# EAGLE design hamilton (EAGLE 6.5.0)
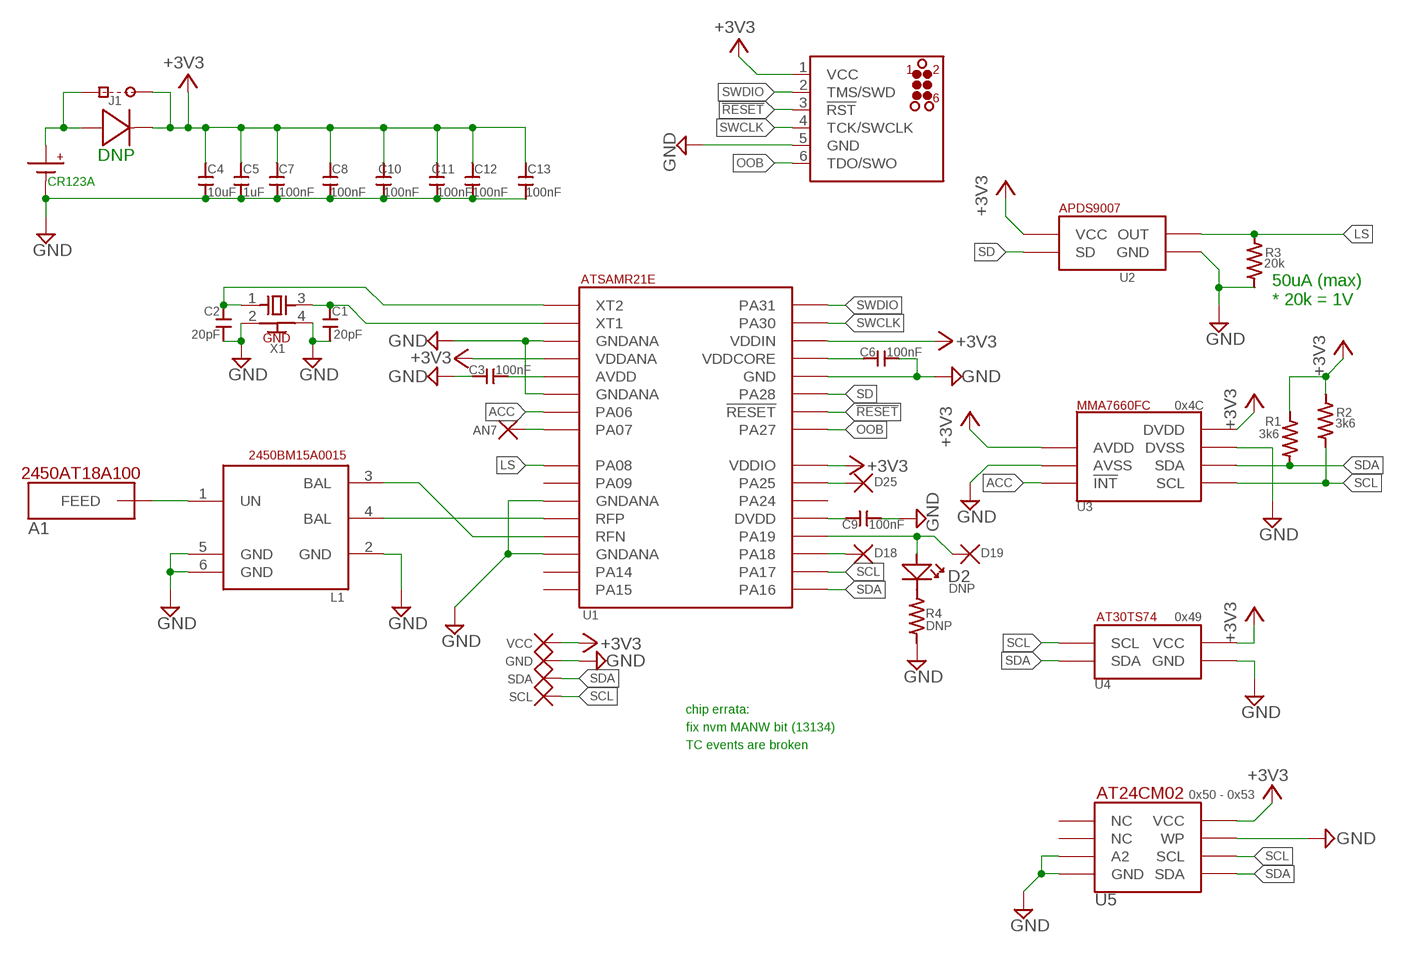
[diagram p0: schematic, sheet 1]

## Parts
A1  JOHANSON_ANTENNA2  [JOHANSON_ANTENNA2]
BT1  2/3A  [2/3A]
C1  20pF  0603_CAPACITORSMALL  [S0402]
C2  20pF  0603_CAPACITORSMALL  [S0402]
C3  100nF  0603_CAPACITOR0402  [C0402]
C4  10uF  0805_CAPACITOR  [0805]
C5  1uF  0603_CAPACITOR0402  [C0402]
C6  100nF  0603_CAPACITOR0402  [C0402]
C7  100nF  0603_CAPACITOR0402  [C0402]
C8  100nF  0603_CAPACITOR0402  [C0402]
C9  100nF  0603_CAPACITOR0402  [C0402]
C10  100nF  0603_CAPACITOR0402  [C0402]
C11  100nF  0603_CAPACITOR0402  [C0402]
C12  100nF  0603_CAPACITOR0402  [C0402]
C13  100nF  0603_CAPACITOR0402  [C0402]
D1  SOD523F  [SOD523F]
D2  DNP  STATLED  [LINE_0805]
J1  CUTJ2  [CUT3]
L1  BALUN_JOHANSON  [BALUN_JOHANSON]
R1  3k6  0603_RESISTORSMALL  [S0402]
R2  3k6  0603_RESISTORSMALL  [S0402]
R3  20k  0603_RESISTORSMALL  [S0402]
R4  DNP  0603_RESISTORSMALL  [S0402]
TP1  D19  TP  [TPP]
TP2  D18  TP  [TPP]
TP3  AN7  TP  [TPP]
TP4  D25  TP  [TPP]
TP5  VCC  TP  [TPP]
TP6  GND  TP  [TPP]
TP7  SDA  TP  [TPP]
TP8  SCL  TP  [TPP]
U1  SAMR21  [QFN32]
U2  APDS9007  [APDS9007]
U3  MMA7660FC  [MMA7660]
U4  AT30TS74  [4WLCSP]
U5  AT24CM02  [SO8]
U$1  JLINK_CONNECT  [TC2030-MCP-NL]
X1  XTAL  [XTAL]

## Nets
!RESET!: U1.26(!RESET!) U$1.3(!RST!)
+3V3: C4.2 C5.2 C7.1 C8.1 C10.1 C11.1 C12.1 C13.1 D1.NEG J1.P$1(R) R1.P$2 R2.P$2 TP5.P$1 U1.4(VDDANA) U1.24(VDDIO) U1.30(VDDIN) U2.4(VCC) U3.3(AVDD) U3.9(DVDD) U4.A1(VCC) U5.8(VCC) U$1.1(VCC)
ACC: U1.7(PA06) U3.5(!INT!)
GND: BT1.NEG(-) C1.P$1 C2.P$1 C3.2 C4.1 C5.1 C6.1 C7.2 C8.2 C9.1 C10.2 C11.2 C12.2 C13.2 L1.2(GND) L1.5(GND) L1.6(GND) R3.P$1 R4.P$1 TP6.P$1 U1.3(GNDANA) U1.6(GNDANA) U1.11(GNDANA) U1.14(GNDANA) U1.28(GND) U2.1(GND) U3.4(AVSS) U3.8(DVSS) U4.A2(GND) U5.3(A2) U5.4(GND) U5.7(WP) U$1.5(GND) X1.2(GND) X1.4(GND)
LS: R3.P$2 U1.9(PA08) U2.3(OUT)
N$1: BT1.POS(+) D1.POS J1.P$2(SQ)
N$2: L1.3(BAL) U1.13(RFN)
N$3: A1.FEED L1.1(UN)
N$4: C2.P$2 U1.1(XT2) X1.1(X1)
N$5: C6.2 U1.29(VDDCORE)
N$6: C3.1 U1.5(AVDD)
N$7: C1.P$2 U1.2(XT1) X1.3(X2)
N$8: TP3.P$1 U1.8(PA07)
N$9: TP4.P$1 U1.23(PA25)
N$10: C9.2 U1.21(DVDD)
N$11: D2.NOLINE(+) TP1.P$1 U1.20(PA19)
N$12: TP2.P$1 U1.19(PA18)
N$13: L1.4(BAL) U1.12(RFP)
N$14: D2.LINE(-) R4.P$2
OOB: U1.25(PA27) U$1.6(TDO/SWO)
SCL: R2.P$1 TP8.P$1 U1.18(PA17) U3.6(SCL) U4.B2(SCL) U5.6(SCL)
SD: U1.27(PA28) U2.6(SD)
SDA: R1.P$1 TP7.P$1 U1.17(PA16) U3.7(SDA) U4.B1(SDA) U5.5(SDA)
SWCLK: U1.31(PA30) U$1.4(TCK/SWCLK)
SWDIO: U1.32(PA31) U$1.2(TMS/SWD)
Unconnected: U1.10(PA09) U1.15(PA14) U1.16(PA15) U1.22(PA24) U5.1(NC) U5.2(NC)

## Notes on the sheet
- DNP
- CR123A
- 50uA (max) 
  * 20k = 1V
- X1
- 0x4C
- DNP
- 0x49
- chip errata:
- fix nvm MANW bit (13134)
- TC events are broken
- 0x50 - 0x53

## Library data of the parts
A1 = storm:JOHANSON_ANTENNA2
BT1 = storm:2/3A
C1-C3 C5-C13 = storm:0603_CAPACITOR
C4 = storm:0805_CAPACITOR
D1 = storm:SOD523F
D2 = storm:STATLED
J1 = storm:CUTJ2
L1 = storm:BALUN_JOHANSON
R1-R4 = storm:0603_RESISTOR
TP1-TP8 = storm:TP
U1 = storm:SAMR21
U2 = storm:APDS9007
U3 = storm:MMA7660FC
U4 = storm:AT30TS74
U5 = storm:AT24CM02
U$1 = storm:JLINK_CONNECT
X1 = storm:XTAL

## Board
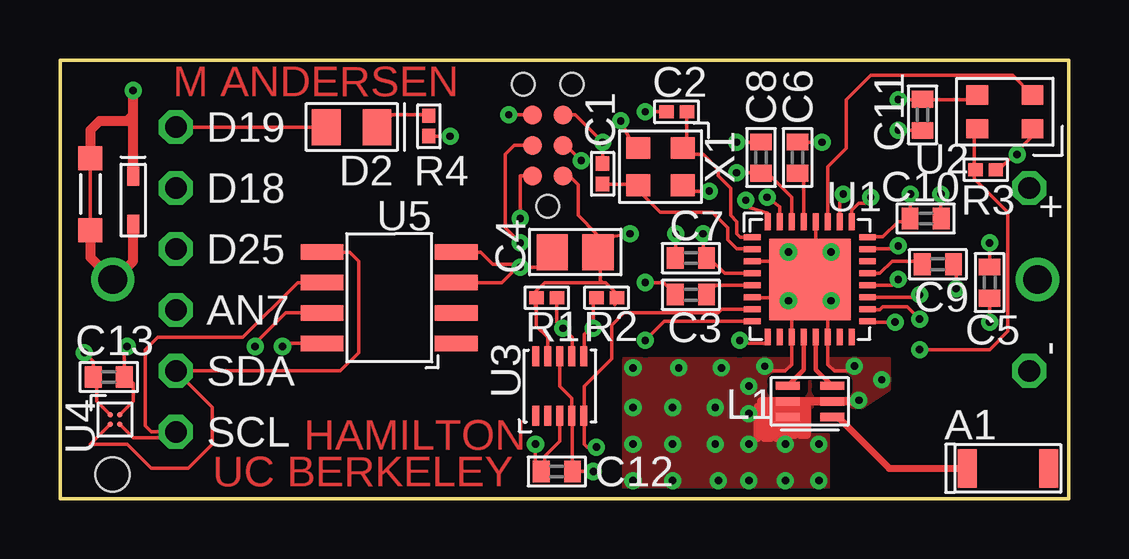
[diagram p1: board, top side]
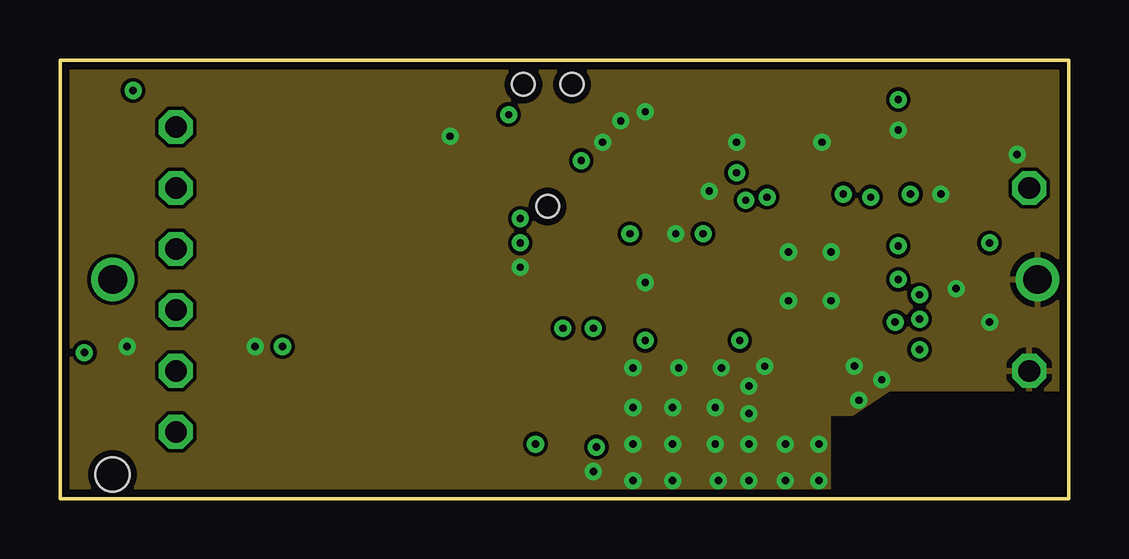
[diagram p2: board, inner layer Route2]
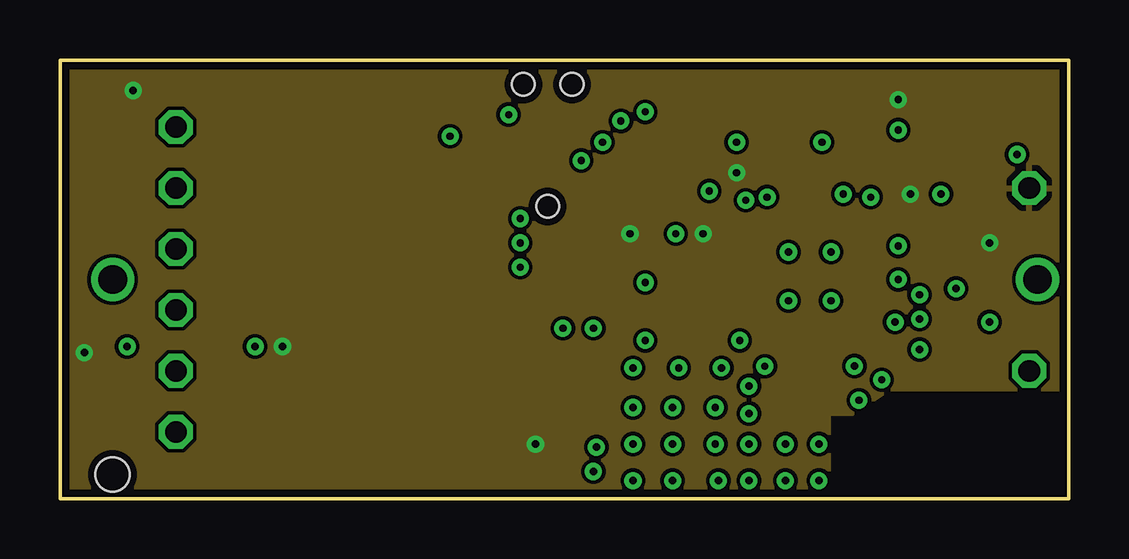
[diagram p3: board, inner layer Route15]
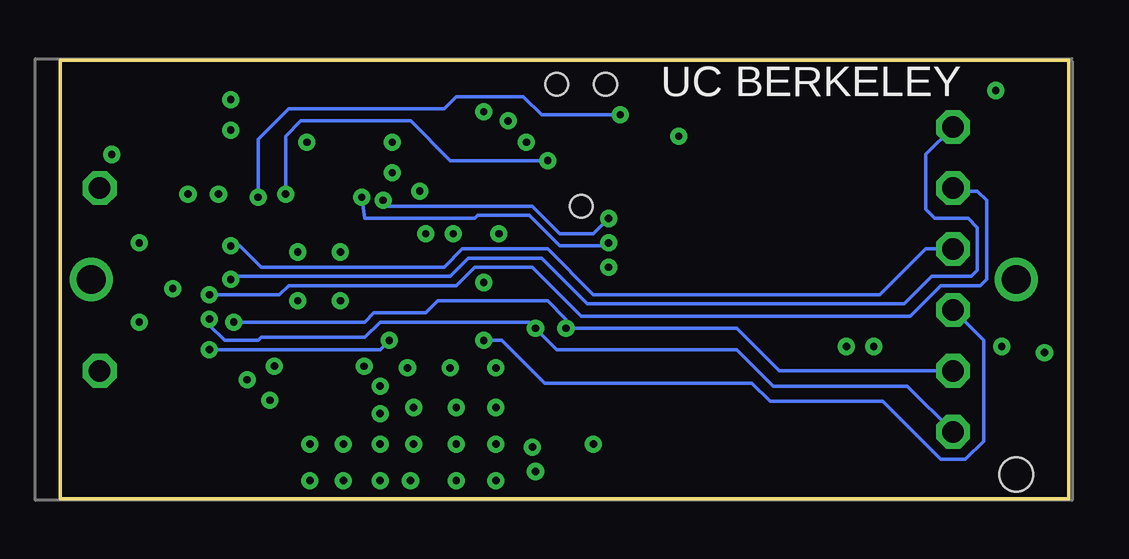
[diagram p4: board, bottom side, seen from below]

Size 42.04 x 18.29 mm. Coordinates in mm from the lower left corner, seen from the top.
Outline: 0,18.29 42.04,18.29 42.04,0 0,0 0,18.29
Copper layers (1*2*15*16): Top 0.035mm / dielectric 1.5mm / Route2 0.035mm / dielectric 0.15mm / Route15 0.035mm / dielectric 0.2mm / Bottom 0.035mm
Design rules "default *": minimum track width 6mil, minimum drill 12mil, track to track 6mil, track to pad 6mil, pad to pad 6mil, via to via 6mil, smd to smd 6mil, copper to edge 12mil, drill to drill 8mil, minimum pad ring 10mil, minimum via ring 8mil, stop-mask expansion 4mil, vias tented up to drill 12mil, thermal gap 10mil

### Footprints (pad centres in the part's own frame; a part is rotated, then mirrored left to right if it is on the bottom)
JOHANSON_ANTENNA2 = smd 0.8 x 1.6: FEED -1.7,0; NC 1.7,0
2/3A = drill 1.2: NEG -19.27,0; POS 19.27,0 | hole 1.42: 19.27,-8.13
S0402 = smd 0.6 x 0.55: P$1 0,0; P$2 0.85,0
C0402 = smd 0.7 x 0.9: 1 -0.65,0; 2 0.65,0
0805 = smd 1.3 x 1.5: 1 -0.95,0; 2 0.95,0
SOD523F = smd 0.8 x 0.5: NEG 1,0; POS -1,0
LINE_0805 = smd 1.2 x 1.5: LINE 0,0; NOLINE 2.11,0
CUT3 = smd 1 x 1: P$1 -1.5,0; P$2 1.5,0
BALUN_JOHANSON = smd 1 x 0.35: 1 -0.925,0.65; 2 -0.925,0; 3 -0.925,-0.65; 4 0.925,-0.65; 5 0.925,0; 6 0.925,0.65
TPP = drill 0.9 octagon: P$1 0,0
QFN32 = smd 0.7 x 0.25: 1 -2.4,1.75; 2 -2.4,1.25; 3 -2.4,0.75; 4 -2.4,0.25; 5 -2.4,-0.25; 6 -2.4,-0.75; 7 -2.4,-1.25; 8 -2.4,-1.75; 17 2.4,-1.75; 18 2.4,-1.25; 19 2.4,-0.75; 20 2.4,-0.25; 21 2.4,0.25; 22 2.4,0.75; 23 2.4,1.25; 24 2.4,1.75 | smd 0.25 x 0.7: 9 -1.75,-2.4; 10 -1.25,-2.4; 11 -0.75,-2.4; 12 -0.25,-2.4; 13 0.25,-2.4; 14 0.75,-2.4; 15 1.25,-2.4; 16 1.75,-2.4; 25 1.75,2.4; 26 1.25,2.4; 27 0.75,2.4; 28 0.25,2.4; 29 -0.25,2.4; 30 -0.75,2.4; 31 -1.25,2.4; 32 -1.75,2.4 | smd 3.4 x 3.4: PAD 0,0
APDS9007 = smd 0.9 x 0.8: 1 -1.15,0.7; 3 1.15,0.7; 4 1.15,-0.7; 6 -1.15,-0.7
MMA7660 = smd 0.3 x 0.825: 1 -1,-1.24; 2 -0.5,-1.24; 3 0,-1.24; 4 0.5,-1.24; 5 1,-1.24; 6 1,1.24; 7 0.5,1.24; 8 0,1.24; 9 -0.5,1.24; 10 -1,1.24
4WLCSP = smd 0.235 x 0.235: A1 -0.2,0.2; A2 0.2,0.2; B1 -0.2,-0.2; B2 0.2,-0.2
SO8 = smd 1.778 x 0.635: 1 -2.54,2.54; 2 -2.54,1.27; 3 -2.54,0; 4 -2.54,-1.27; 5 3.048,-1.27; 6 3.048,0; 7 3.048,1.27; 8 3.048,2.54
TC2030-MCP-NL = smd 0.787 x 0.787: 1 1.27,-0.635; 2 1.27,0.635; 3 2.54,-0.635; 4 2.54,0.635; 5 3.81,-0.635; 6 3.81,0.635 | hole 0.95: 0,0; 5.08,-1.016; 5.08,1.016
XTAL = smd 1 x 0.9: 1 -0.925,-0.775; 2 0.925,-0.775; 3 0.925,0.775; 4 -0.925,0.775

### Placement (x,y rotation side)
A1  39.5,1.27 0 top
BT1  21.46,9.14 0 bottom
C1  22.61,13.97 270 top
C2  25.27,16.13 0 top
C3  26.29,8.51 180 top
C4  21.46,10.29 0 top
C5  38.73,9.02 90 top
C6  30.73,14.22 270 top
C7  26.29,10.03 180 top
C8  29.21,14.22 90 top
C9  36.58,9.78 180 top
C10  36.07,11.68 0 top
C11  35.94,16 270 top
C12  20.7,1.14 0 top
C13  2.03,5.08 0 top
D1  3.05,12.45 90 top
D2  13.21,15.49 180 top
J1  1.27,12.7 270 top
L1  31.24,4.06 180 top
R1  20.7,8.38 180 top
R2  22.35,8.38 0 top
R3  38.99,13.72 180 top
R4  15.37,15.11 90 top
TP1  4.83,15.49 0 top
TP2  4.83,12.95 0 top
TP3  4.83,7.87 0 top
TP4  4.83,10.41 0 top
TP5  40.39,12.95 180 top
TP6  40.39,5.33 180 top
TP7  4.83,5.34 0 top
TP8  4.83,2.79 0 top
U1  31.24,9.14 0 top
U2  39.37,16.13 180 top
U3  20.83,4.7 0 top
U4  2.29,3.3 0 top
U5  13.97,9.02 180 top
U$1  20.32,12.19 90 top
X1  25.02,13.84 180 top

### Tracks (layer width: path | path; a pad name or v marks a point on that pad's centre or on a via)
!RESET!  (via drill 0.3)
  Top 0.152: U1.26 32.49,12.55 v32.64,12.7 | v21.72,14.1 21.08,14.73 U$1.3
  Bottom 0.152: v32.64,12.7 32.64,15.11 32,15.75 27.43,15.75 25.78,14.1 v21.72,14.1
+3V3  (via drill 0.3)
  Top 0.152: U1.4 27.69,9.39 27.05,10.03 27.05,10.16 26.99,10.22 | 26.99,10.22 26.8,10.41 v26.8,11.05 | U1.24 33.67,10.92 34.29,10.92 34.93,11.56 35.29,11.56 35.4,11.67 35.42,11.67 C10.1 35.43,11.7 v35.43,12.7 | U2.4 38.03,16.64 v34.93,16.64 35.93,16.64 C11.1 | 22.51,10.19 22.54,10.16 | U3.3 20.83,2.41 20.19,1.78 20.19,1.4 20.05,1.25 20.07,1.24 20.07,1.02 20.05,1.03 C12.1 19.81,1.25 v19.81,2.29 | U3.9 20.32,5.95 20.32,6.73 19.85,7.2 R1.P$2 19.81,7.91 19.81,8.64 20.19,9.02 22.61,9.02 | R2.P$2 23.11,8.09 23.11,8.64 22.73,9.02 22.61,9.02 | 22.61,9.02 22.51,9.11 22.51,10.19 | 29.48,13.57 29.53,13.53 | 29.53,13.53 30.48,12.57 30.48,11.56 U1.30 | U$1.1 21.21,13.46 21.59,13.08 21.59,11.81 22.35,11.05 22.35,10.67 | 22.35,10.67 22.35,10.41 | 22.35,10.41 22.35,10.35 | v23.75,11.05 22.99,10.92 22.73,10.67 22.35,10.67 | v28.19,13.59 28.96,13.59 28.97,13.57 C8.1 29.35,13.57 29.46,13.46 29.53,13.53 | C5.2 v38.73,10.67 | 22.51,10.19 C4.2 22.41,10.35 22.35,10.41 | C7.1 26.94,10.17 26.99,10.22 | U4.A1 1.52,4.06 1.52,4.97 C13.1 1.38,5.73 v1.02,6.1 | U5.8 9.4,6.48 v9.27,6.35
  Top 0.406: D1.NEG 3.05,16 | 3.05,16 v3.05,17.02 | 3.05,16 2.79,15.75 1.65,15.75 1.27,15.37 J1.P$1
  pour Route15: 0,18.29 41.66,18.29 42.04,4.57 34.54,4.57 33.02,3.56 32,3.56 32,0 0,0
ACC  (via drill 0.3)
  Top 0.152: U3.5 21.84,3.44 | 21.84,3.44 21.84,2.29 21.97,2.16 v22.35,2.16 | 21.84,3.44 21.84,4.7 22.99,5.84 22.99,7.24 23.49,7.75 27.43,7.75 27.58,7.89 U1.7
GND  (via drill 0.3)
  Top 0.152: 33.15,5.33 32.26,5.33 31.99,5.6 U1.14 31.99,7.74 32,7.75 | 29.46,5.33 30.23,5.33 30.49,5.6 30.48,7.49 30.61,7.75 30.49,7.63 U1.11 | C8.2 28.97,14.87 28.96,14.86 v28.19,14.86 | C6.1 30.99,14.86 v31.75,14.86 | C3.2 25.64,8.27 | 25.64,8.27 25.65,8.26 | C7.2 25.64,10.4 25.65,10.41 v25.65,11.05 | X1.4 26.16,13.07 | 26.16,13.07 26.28,13.07 26.29,13.08 | X1.2 24.09,14.64 23.75,14.99 v23.37,15.75 | C2.P$1 v24.38,16.13 | C1.P$1 v22.61,14.86 21.46,16 U$1.5 | v27.05,12.83 26.29,12.83 26.29,12.95 26.16,13.08 26.16,13.07 | U1.6 28.85,8.38 29.97,8.38 30.1,8.26 v30.35,8.26 | U1.3 28.85,9.91 29.72,9.91 29.84,10.03 v30.35,10.29 | U1.28 31.5,10.41 31.88,10.03 v32.13,10.29 | C10.2 36.7,11.7 v36.7,12.7 | C9.1 37.34,9.38 v37.34,8.76 | C5.1 v38.73,7.37 | C11.2 35.93,15.37 v34.93,15.37 | 21.35,1.25 21.34,1.27 U3.4 21.33,4.2 20.83,4.7 U3.8 | 21.35,1.25 C12.2 | 21.35,1.25 21.46,1.14 v22.23,1.14 | 25.64,8.27 25.4,8.51 25.4,8.76 25.15,9.02 v24.38,9.02 | C4.1 20.19,9.97 20.19,9.65 v19.18,9.65 19.11,9.72 | R3.P$1 39.12,13.72 39.62,14.22 39.75,14.22 v39.88,14.35 39.88,14.48 40.52,15.12 U2.1 | U4.A2 3.05,4.06 3.05,4.83 2.79,5.08 C13.2 2.68,6.24 v2.79,6.35 | R4.P$1 v16.26,15.11 | U5.4 17.53,10.29 18.03,9.78 19.05,9.78 19.11,9.72 | U5.3 18.41,9.02 19.11,9.72 | U5.7 9.4,7.75 8.13,6.48 v8.13,6.35
  Top 0.356: 33.4,4.06 L1.5 29.21,4.06 29.21,3.81 | 29.21,3.81 29.34,3.81 | 29.34,3.81 31.12,3.81 31.12,2.67 30.86,2.67 30.86,3.68 30.61,3.68 30.61,2.67 30.48,2.67 30.35,2.54 30.35,3.68 30.1,3.68 30.1,2.54 29.84,2.54 29.84,3.68 29.59,3.68 29.59,2.54 29.34,2.54 29.34,3.81 | 29.21,3.81 29.08,3.81 29.08,2.54
  other vias: 27.56,5.46 25.78,5.46 23.88,5.46 23.88,3.81 25.53,3.81 27.3,3.81 29.37,5.53 28.7,4.7 28.7,3.56 28.7,2.29 30.23,2.29 31.62,2.29 31.62,0.76 30.23,0.76 28.7,0.76 27.43,0.76 25.53,0.76 27.3,2.29 25.53,2.29 23.88,2.29 23.88,0.76 33.1,5.53 34.24,4.96 33.29,4.11 32.13,8.26
  pour Route2: 0,18.29 41.78,18.29 42.16,4.57 34.54,4.57 33.02,3.56 32,3.56 32,0 0,0
  pour Top (isolate 0.356): 30.48,5.84 23.49,5.84 23.49,0 32,0 32,2.67 31.24,2.67 31.24,3.81 33.4,3.81 34.54,4.57 34.54,5.84
LS  (via drill 0.3)
  Top 0.152: U2.3 38.27,15.38 38.12,15.38 38.1,15.37 38.1,13.76 R3.P$2 38.1,13.68 38.1,13.33 39.5,11.94 39.5,6.99 38.73,6.22 v35.81,6.22 | v28.32,6.6 28.7,6.48 29.46,6.48 29.49,6.51 U1.9
  Bottom 0.152: v35.81,6.22 28.7,6.22 v28.32,6.6
N$1
  Top 0.406: D1.POS 3.05,9.91 2.29,9.14 BT1.POS 1.27,10.07 J1.P$2
N$2
  Top 0.178: U1.13 31.49,5.39 L1.3
N$3
  Top 0.3: L1.1 32.4,3.41 34.54,1.27 A1.FEED
N$4
  Top 0.152: U1.1 28.35,10.89 28.19,11.05 28.19,11.56 27.94,11.81 27.94,12.95 27.43,13.46 27.43,13.72 26.8,14.35 26.21,14.35 X1.1 26.12,14.8 C2.P$2
N$5
  Top 0.152: U1.29 30.99,13.33 30.99,13.36 30.84,13.51 | 30.73,13.46 30.84,13.51 | 30.84,13.51 30.99,13.59 C6.2
N$6
  Top 0.152: U1.5 27.32,8.89 C3.1
N$7
  Top 0.152: U1.2 28.82,10.41 28.19,10.41 27.81,10.79 27.81,11.3 27.18,11.94 25.02,11.94 24.09,12.86 X1.3 24.04,13.12 C1.P$2
N$8  (via drill 0.3)
  Top 0.152: U1.8 25.17,7.39 v24.38,6.6
  Bottom 0.152: v24.38,6.6 23.62,6.6 21.84,4.83 13.21,4.83 12.45,4.06 7.75,4.06 5.33,1.65 4.32,1.65 3.56,2.41 3.56,6.6 TP3.P$1
N$9  (via drill 0.3)
  Top 0.152: U1.23 33.89,10.39 33.91,10.41 34.8,10.41 v34.93,10.54
  Bottom 0.152: v34.93,10.54 34.54,10.54 33.66,9.65 26.04,9.65 25.27,10.41 21.72,10.41 19.81,8.51 7.87,8.51 5.97,10.41 TP4.P$1
N$10
  Top 0.152: U1.21 34.16,9.4 34.67,9.91 35.94,9.91 35.94,9.79 C9.2
N$11  (via drill 0.3)
  Top 0.152: U1.20 34.68,8.89 v34.93,9.14 | D2.NOLINE TP1.P$1
  Bottom 0.152: v34.93,9.14 34.8,9.27 25.78,9.27 25.02,10.03 21.97,10.03 20.07,8.13 6.86,8.13 5.71,9.27 4.06,9.27 3.81,9.53 3.81,11.3 4.19,11.68 5.59,11.68 5.97,12.06 5.97,14.35 TP1.P$1
N$12  (via drill 0.3)
  Top 0.152: U1.19 35.7,8.39 v35.81,8.51
  Bottom 0.152: v35.81,8.51 32.89,8.51 32.51,8.89 25.53,8.89 24.77,9.65 22.35,9.65 20.32,7.62 6.6,7.62 5.33,8.89 3.68,8.89 3.43,9.14 3.43,12.45 3.81,12.83 4.7,12.83 TP2.P$1
N$13
  Top 0.178: U1.12 30.99,5.39 L1.4
N$14
  Top 0.152: D2.LINE 13.34,15.49 13.84,16 15.33,16 R4.P$2
OOB  (via drill 0.3)
  Top 0.152: U1.25 32.99,12.04 33.27,12.32 33.53,12.32 v33.78,12.57 | U$1.6 18.7,16 v18.7,16.01
  Bottom 0.152: v33.78,12.57 33.78,14.99 32.51,16.26 26.04,16.26 25.53,16.76 22.73,16.76 21.97,16 19.05,16 v18.7,16.01
SCL  (via drill 0.3)
  Top 0.152: U3.6 21.84,5.96 21.84,6.86 22.1,7.11 v22.23,7.11 22.23,8.26 R2.P$1 | U1.18 33.66,7.87 34.16,7.87 34.29,8 35.31,8 v35.81,7.49 | U5.6 9.91,9.02 7.62,6.73 4.06,6.73 3.56,6.22 3.56,3.05 3.81,2.79 TP8.P$1 | U4.B2 3.05,2.54 4.57,2.54 TP8.P$1 | TP8.P$1
  Bottom 0.152: TP8.P$1 6.73,4.7 12.32,4.7 13.84,6.22 21.34,6.22 v22.23,7.11 22.48,7.37 28.7,7.37 29.34,6.73 33.66,6.73 33.78,6.6 35.18,6.6 35.81,7.24 v35.81,7.49
SD
  Top 0.152: U2.6 39.7,17.65 33.78,17.65 32.77,16.64 32.77,14.6 31.99,13.83 U1.27
SDA  (via drill 0.3)
  Top 0.152: U3.7 21.33,5.96 21.34,5.97 21.34,6.73 v20.96,7.11 20.7,7.37 R1.P$1 | U1.17 33.67,7.37 v34.8,7.37 | TP7.P$1 | TP7.P$1 | U5.5 12.07,10.29 12.45,9.91 12.45,6.1 11.68,5.33 TP7.P$1 | TP7.P$1 6.35,3.81 6.35,2.29 5.33,1.27 3.81,1.27 2.79,2.29 1.27,2.29 U4.B1
  Bottom 0.152: TP7.P$1 12.07,5.33 13.84,7.11 v20.96,7.11 20.96,7.49 21.72,8.26 26.29,8.26 26.8,7.75 28.96,7.75 29.34,7.37 v34.8,7.37
SWCLK  (via drill 0.3)
  Top 0.152: U1.31 29.99,12.17 v29.46,12.57 | v19.18,10.67 18.54,11.3 18.54,14.35 18.92,14.73 U$1.4
  Bottom 0.152: v29.46,12.57 29.34,11.68 24.77,11.68 24.64,11.81 22.48,11.81 21.21,10.54 19.3,10.54 v19.18,10.67
SWDIO  (via drill 0.3)
  Top 0.152: U1.32 29.49,11.91 28.96,12.06 28.58,12.19 v28.58,12.45 | v19.18,11.68 19.18,13.46 U$1.2
  Bottom 0.152: v28.58,12.45 28.58,12.19 22.35,12.19 21.21,11.05 19.81,11.05 v19.18,11.68

### Text on the board
Top: M ANDERSEN | HAMILTON | UC BERKELEY
tPlace: X1 | U1 | + | -
bPlace: UC BERKELEY
tStop: M ANDERSEN | HAMILTON | UC BERKELEY